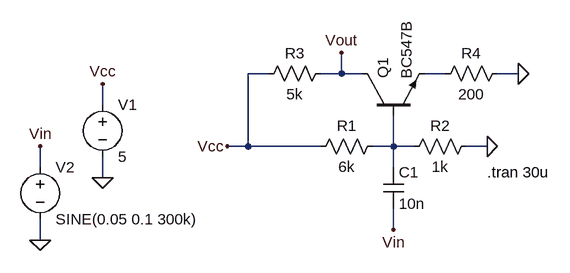
[diagram p0: schematic amplifier_test1.asc]
amplifier_test1.asc, the LTspice schematic file:
Version 4
SHEET 1 880 680
WIRE -48 96 -80 96
WIRE 64 96 64 64
WIRE 64 96 32 96
WIRE 96 96 64 96
WIRE 224 96 192 96
WIRE 336 96 304 96
WIRE -304 144 -304 112
WIRE -80 208 -80 96
WIRE -80 208 -112 208
WIRE 32 208 -80 208
WIRE 144 208 144 160
WIRE 144 208 112 208
WIRE 176 208 144 208
WIRE 288 208 256 208
WIRE -400 240 -400 208
WIRE 144 240 144 208
WIRE -304 256 -304 224
WIRE 144 336 144 304
WIRE -400 352 -400 320
FLAG 288 208 0
FLAG -112 208 Vcc
FLAG 144 336 Vin
FLAG 64 64 Vout
FLAG 336 96 0
FLAG -304 256 0
FLAG -304 112 Vcc
FLAG -400 352 0
FLAG -400 208 Vin
SYMBOL npn 96 160 R270
SYMATTR InstName Q1
SYMATTR Value BC547B
SYMBOL res 128 192 R90
WINDOW 0 0 56 VBottom 2
WINDOW 3 32 56 VTop 2
SYMATTR InstName R1
SYMATTR Value 6k
SYMBOL res 272 192 R90
WINDOW 0 0 56 VBottom 2
WINDOW 3 32 56 VTop 2
SYMATTR InstName R2
SYMATTR Value 1k
SYMBOL cap 128 240 R0
SYMATTR InstName C1
SYMATTR Value 10n
SYMBOL res 48 80 R90
WINDOW 0 0 56 VBottom 2
WINDOW 3 32 56 VTop 2
SYMATTR InstName R3
SYMATTR Value 5k
SYMBOL voltage -304 128 R0
WINDOW 123 0 0 Left 0
WINDOW 39 0 0 Left 0
SYMATTR InstName V1
SYMATTR Value 5
SYMBOL voltage -400 224 R0
WINDOW 123 0 0 Left 0
WINDOW 39 0 0 Left 0
SYMATTR InstName V2
SYMATTR Value SINE(0.05 0.1 300k)
SYMBOL res 208 112 R270
WINDOW 0 32 56 VTop 2
WINDOW 3 0 56 VBottom 2
SYMATTR InstName R4
SYMATTR Value 200
TEXT 288 248 Left 2 !.tran 30u

The netlist it stands for:
* amplifier_test1.asc
Q1 Vout N002 N001 0 BC547B
R1 N002 Vcc 6k
R2 0 N002 1k
C1 N002 Vin 10n
R3 Vout Vcc 5k
V1 Vcc 0 5
V2 Vin 0 SINE(0.05 0.1 300k)
R4 N001 0 200
.model NPN NPN
.model PNP PNP
.lib standard.bjt
.tran 30u
.backanno
.end